# EAGLE schematic AVR-USB2SERIAL (EAGLE 9.6.0)
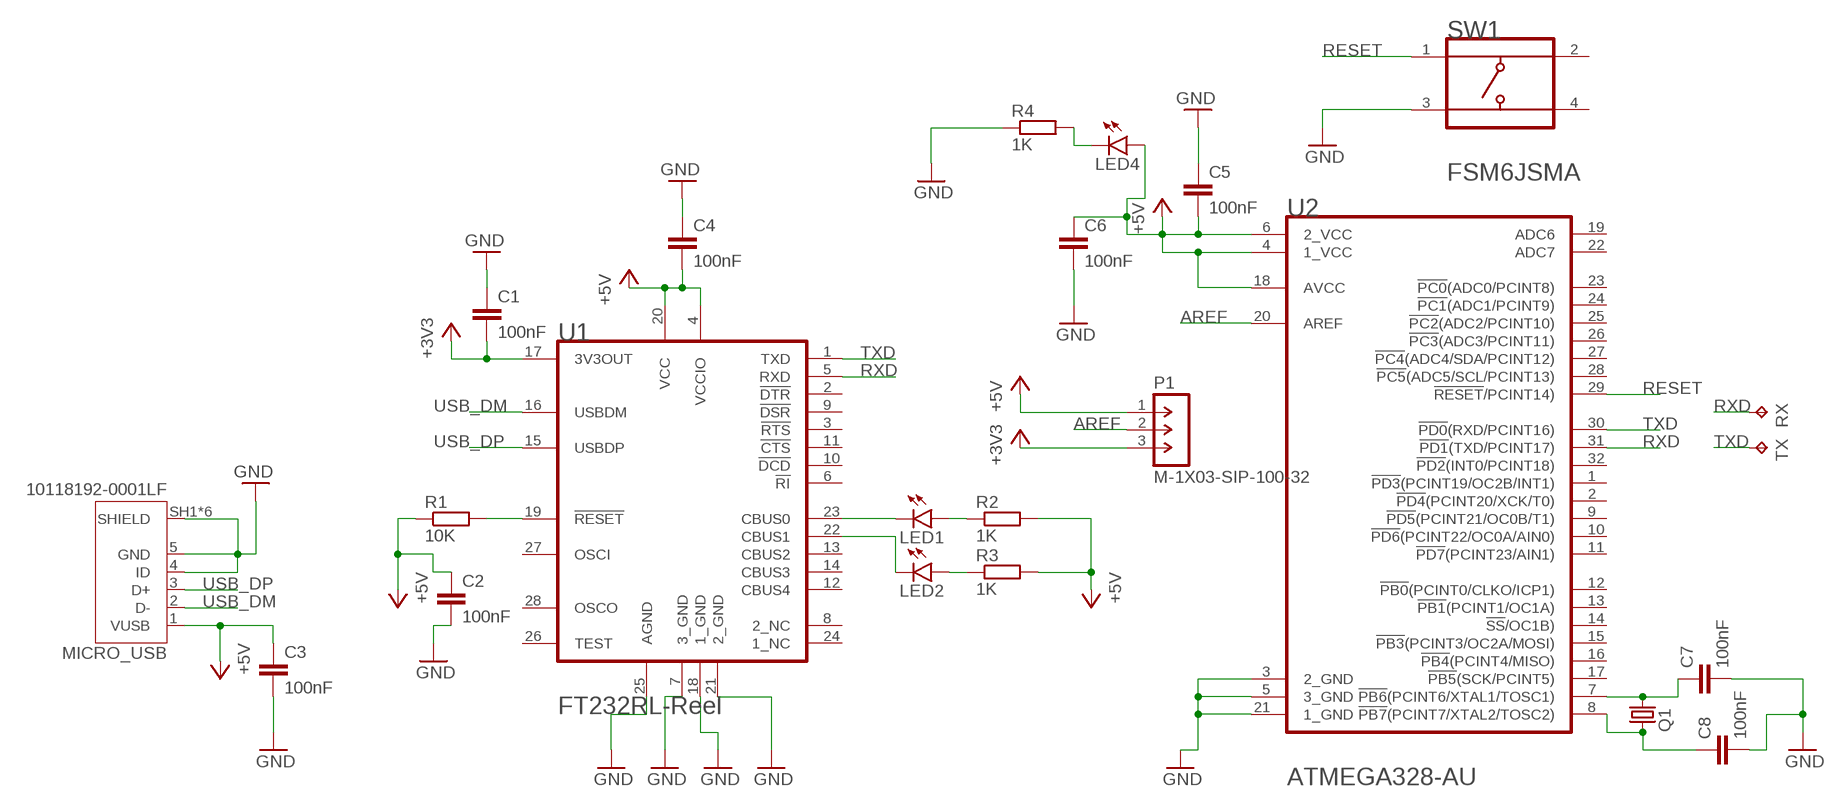
[diagram p0: schematic, sheet 1]

## Parts
C1  100nF  C-EUC0805  [C0805]
C2  100nF  C-EUC0805  [C0805]
C3  100nF  C-EUC0805  [C0805]
C4  100nF  C-EUC0805  [C0805]
C5  100nF  C-EUC0805  [C0805]
C6  100nF  C-EUC0805  [C0805]
C7  100nF  C-EUC0805  [C0805]
C8  100nF  C-EUC0805  [C0805]
LED1  LEDCHIPLED_0805  [CHIPLED_0805]
LED2  LEDCHIPLED_0805  [CHIPLED_0805]
LED4  LEDCHIPLED_0805  [CHIPLED_0805]
MICRO_USB  10118192-0001LF  [AMPHENOL_10118192-0001LF]
P1  M-1X03-SIP-100-32  [SIP-100-03-32]
Q1  CRYSTALHC49UP  [HC49UP]
R1  10K  R-EU_R0805  [R0805]
R2  1K  R-EU_R0805  [R0805]
R3  1K  R-EU_R0805  [R0805]
R4  1K  R-EU_R0805  [R0805]
RX  TPB1,27  [B1,27]
SW1  TE_CONNECTIVITY_ALCOSWITCH_FSM6JSMATE_CONNECTIVITY_ALCOSWITCH_FSM6JSMA_0_0  [TE_CONNECTIVITY_ALCOSWITCH_FSM6JSMA_0]
TX  TPB1,27  [B1,27]
U1  FTDI_FT232RL-REELFTDI_FT232RL-REEL_0_0  [FTDI_FT232RL-REEL_0]
U2  MICROCHIP_-_ATMEL_ATMEGA328-AUMICROCHIP_-_ATMEL_ATMEGA328-AU_0_0  [MICROCHIP_-_ATMEL_ATMEGA328-AU_0]

## Nets
+3V3 [POWER]: C1.2 P1.3 U1.17(3V3OUT)
+5V [POWER]: C2.1 C3.1 C4.2 C5.2 C6.1 LED4.A MICRO_USB.1(VUSB) P1.1 R1.1 R2.2 R3.2 U1.4(VCCIO) U1.20(VCC) U2.4(1_VCC) U2.6(2_VCC) U2.18(AVCC)
AREF: P1.2 U2.20(AREF)
GND [POWER]: C1.1 C2.2 C3.2 C4.1 C5.1 C6.2 C7.2 C8.2 MICRO_USB.4(ID) MICRO_USB.5(GND) MICRO_USB.SH1(SHIELD) MICRO_USB.SH2(SHIELD) MICRO_USB.SH3(SHIELD) MICRO_USB.SH4(SHIELD) MICRO_USB.SH5(SHIELD) MICRO_USB.SH6(SHIELD) R4.1 SW1.3 U1.7(3_GND) U1.18(1_GND) U1.21(2_GND) U1.25(AGND) U2.3(2_GND) U2.5(3_GND) U2.21(1_GND)
N$1: LED1.A R2.1
N$2: R1.2 U1.19(!RESET!)
N$3: LED1.C U1.23(CBUS0)
N$4: LED2.A R3.1
N$5: LED2.C U1.22(CBUS1)
N$6: C7.1 Q1.2 U2.7(!PB6!(PCINT6/XTAL1/TOSC1))
N$7: C8.1 Q1.1 U2.8(!PB7!(PCINT7/XTAL2/TOSC2))
N$8: LED4.C R4.2
RESET: SW1.1 U2.29(!RESET!/PCINT14))
RXD: RX.TP U1.5(RXD) U2.31(!PD1!(TXD/PCINT17))
TXD: TX.TP U1.1(TXD) U2.30(!PD0!(RXD/PCINT16))
USB_DM: MICRO_USB.2(D-) U1.16(USBDM)
USB_DP: MICRO_USB.3(D+) U1.15(USBDP)
Unconnected: SW1.2 SW1.4 U1.2(!DTR!) U1.3(!RTS!) U1.6(!RI!) U1.8(2_NC) U1.9(!DSR!) U1.10(!DCD!) U1.11(!CTS!) U1.12(CBUS4) U1.13(CBUS2) U1.14(CBUS3) U1.24(1_NC) U1.26(TEST) U1.27(OSCI) U1.28(OSCO) U2.1(!PD3!(PCINT19/OC2B/INT1)) U2.2(!PD4!(PCINT20/XCK/T0)) U2.9(!PD5!(PCINT21/OC0B/T1)) U2.10(!PD6!(PCINT22/OC0A/AIN0)) U2.11(!PD7!(PCINT23/AIN1)) U2.12(!PB0!(PCINT0/CLKO/ICP1)) U2.13(!PB1!(PCINT1/OC1A)) U2.14(!SS!/OC1B)) U2.15(!PB3!(PCINT3/OC2A/MOSI)) U2.16(!PB4!(PCINT4/MISO)) U2.17(!PB5!(SCK/PCINT5)) U2.19(ADC6) U2.22(ADC7) U2.23(!PC0!(ADC0/PCINT8)) U2.24(!PC1!(ADC1/PCINT9)) U2.25(!PC2!(ADC2/PCINT10)) U2.26(!PC3!(ADC3/PCINT11)) U2.27(!PC4!(ADC4/SDA/PCINT12)) U2.28(!PC5!(ADC5/SCL/PCINT13)) U2.32(!PD2!(INT0/PCINT18))

## Library data of the parts
C1-C8 = rcl:C-EU: CAPACITOR, European symbol; SPICEPREFIX: C
LED1 LED2 LED4 = led:LED: LED OSRAM: - CHIPLED LG R971, LG N971, LY N971, LG Q971, LY Q971, LO R971, LY R971 LH N974, LH R974 LS Q976, LO Q976, LY Q976 LO Q996 - Hyper CHIPLED LW Q18S LB Q993, LB Q99A, LB R99A - SideLED LS A670, LO A670, LY A670, LG A670, LP A670 LB A673, LV A673, LT A673, LW A673 LH A674 LY A675 LS A676, LA A676, LO A676, LY A676, LW A676 LS A679, LY A679, LG A679 - Hyper Micro SIDELED® LS Y876, LA Y876, LO Y876, LY Y876 LT Y87S - SmartLED LW L88C, LW L88S LB L89C, LB L89S, LG L890 LS L89K, LO L89K, LY L89K LS L896, LA L896, LO L896, LY L896 - TOPLED LS T670, LO T670, LY T670, LG T670, LP T670 LSG T670, LSP T670, LSY T670, LOP T670, LYG T670 LG T671, LOG T671, LSG T671 LB T673, LV T673, LT T673, LW T673 LH T674 LS T676, LA T676, LO T676, LY T676, LB T676, LH T676, LSB T676, LW T676 LB T67C, LV T67C, LT T67C, LS T67K, LO T67K, LY T67K, LW E67C LS E67B, LA E67B, LO E67B, LY E67B, LB E67C, LV E67C, LT E67C LW T67C LS T679, LY T679, LG T679 LS T770, LO T770, LY T770, LG T770, LP T770 LB T773, LV T773, LT T773, LW T773 LH T774 LS E675, LA E675, LY E675, LS T675 LS T776, LA T776, LO T776, LY T776, LB T776 LHGB T686 LT T68C, LB T68C - Hyper Mini TOPLED® LB M676 - Mini TOPLED Santana® LG M470 LS M47K, LO M47K, LY M47K Source: http://www.osram.convergy.de LUXEON: - LUMILED® LXK2-PW12-R00, LXK2-PW12-S00, LXK2-PW14-U00, LXK2-PW14-V00 LXK2-PM12-R00, LXK2-PM12-S00, LXK2-PM14-U00 LXK2-PE12-Q00, LXK2-PE12-R00, LXK2-PE12-S00, LXK2-PE14-T00, LXK2-PE14-U00 LXK2-PB12-K00, LXK2-PB12-L00, LXK2-PB12-M00, LXK2-PB14-N00, LXK2-PB14-P00, LXK2-PB14-Q00 LXK2-PR12-L00, LXK2-PR12-M00, LXK2-PR14-Q00, LXK2-PR14-R00 LXK2-PD12-Q00, LXK2-PD12-R00, LXK2-PD12-S00 LXK2-PH12-R00, LXK2-PH12-S00 LXK2-PL12-P00, LXK2-PL12-Q00, LXK2-PL12-R00 Source: www.luxeon.com KINGBRIGHT: KA-3528ASYC Source: www.kingbright.com
MICRO_USB = 10118192-0001LF:10118192-0001LF: Single Port 5 Contact Horizontal Right Angle Shielded Micro B USB 2.0 Connector; AVAILABILITY: Unavailable; DESCRIPTION: USB - micro B USB 2.0 Receptacle Connector 5 Position Surface Mount, Right Angle; MF: Amphenol ICC; MP: 10118192-0001LF; PACKAGE: None; PRICE: None
P1 = con-headers-jp:M-1X03-: MALE HEADER
Q1 = crystal:CRYSTAL: CRYSTAL; OC_FARNELL: unknown; OC_NEWARK: unknown
R1-R4 = rcl:R-EU_: RESISTOR, European symbol; SPICEPREFIX: R
RX TX = testpad:TP: Test pad
SW1 = TE Connectivity Alcoswitch - FSM6JSMA:TE_CONNECTIVITY_ALCOSWITCH_FSM6JSMA: SW-SPST-4_A; ACTUATOR_LENGTH: 3.4mm; ACTUATOR_MATERIAL: Polyamide; CASE_PACKAGE: SMD/SMT; CIIVA_IDS: 1274973; CONTACT_CURRENT_RATING: 50mA; CONTACT_MATERIAL: CopperAlloy; CONTACT_PLATING: Silver; CONTACT_RESISTANCE: 100mOhm; CURRENT_RATING: 50mA; DATASHEET_URL: http://www.te.com/commerce/DocumentDelivery/DDEController?Action=showdoc&DocId=Customer+Drawing%7F2-1437565-7%7FV%7Fpdf%7FEnglish%7FENG_CD_2-1437565-7_V.pdf%7F4-1437565-9; DATASHEET_VERSION: Rev. V, 02/2015; ELECTRICAL_LIFE: 100000Cycles; ELV: Compliant; FOOTPRINT_VARIANT_NAME_0: Manufacturer Recommended; ILLUMINATION_TYPE: Illuminated; IMPORTED: yes; IMPORTED_FROM: vault; IMPORT_TS: 1521849377; INSULATION_RESISTANCE: 100MOhm; LEAD_FREE: LeadFree; LENGTH: 6mm; MANUFACTURER_URL: http://www.te.com/; MAX_OPERATING_TEMPERATURE: 85degC; MAX_VOLTAGE_RATING_DC: 12V; MECHANICAL_LIFE: 100000Cycles; MF: TE Connectivity Alcoswitch; MIN_OPERATING_TEMPERATURE: -35degC; MOUNT: SurfaceMount; MOUNTING_TECHNOLOGY: SurfaceMount; MPN: FSM6JSMA; OPERATING_FORCE: 1.57N; ORIENTATION: Straight; PACKAGE_DESCRIPTION: 4-Pin Surface Mount Device, Body 6 x 6 mm, Pitch 4.5 mm; PACKAGE_QUANTITY: 750; PACKAGE_REFERENCE: FSM6JSMA; PACKAGING: LoosePiece; PREFIX: SW; REACH_SVHC: Unknown; RELEASE_DATE: 1509013769; RO_HSCOMPLIANT: true; SWITCH_TRAVEL: 0.25mm; TERMINATION: GullWing; THROW_CONFIGURATION: SPST; VAULT_GUID: D91E59A4-7ECE-42E7-B8F2-8FC7849F8004; VAULT_REVISION: 6365A965-D9F5-4BD9-837C-B5AE3D60004A; VOLTAGE_RATING: 24V; VOLTAGE_RATING_DC: 24V; WIDTH: 6mm
U1 = FTDI - FT232RL-Reel:FTDI_FT232RL-REEL: COM-UART-FT232R-IL28; CIIVA_IDS: 1315748; COMPONENT_LINK_1_DESCRIPTION: Manufacturer URL; COMPONENT_LINK_1_URL: http://www.ftdichip.com/; DATASHEET: http://www.ftdichip.com/Support/Documents/DataSheets/ICs/DS_FT232R.pdf; DATASHEET_VERSION: ver 2.10, Mar-2012; FOOTPRINT_VARIANT_NAME_0: Level C; FOOTPRINT_VARIANT_NAME_1: Level B; FOOTPRINT_VARIANT_NAME_2: Level A; IMPORTED: yes; IMPORTED_FROM: vault; IMPORT_TS: 1521861698; MF: FTDI; MPN: FT232RL-Reel; PACKAGE: SSOP-28; PACKAGE_DESCRIPTION: 28-Pin Small Outline Package 0.65 mm Pitch; PACKAGE_VERSION: Mar-12; PREFIX: U; RELEASE_DATE: 1383903520; VAULT_GUID: DB808BAC-7AAA-4FBB-A28B-8882F1AB516B; VAULT_REVISION: EB4419C0-B99E-4E79-9F0E-CB6725B6F5C3
U2 = Atmel - ATMEGA328-AU:MICROCHIP_-_ATMEL_ATMEGA328-AU: MC-8B-ATM48-SQ32; CIIVA_IDS: 973152; CODE__JEDEC: MS-026-ABA; COMPONENT_LINK_1_DESCRIPTION: Manufacturer URL; COMPONENT_LINK_1_URL: http://www.atmel.com/; COMPONENT_LINK_2_DESCRIPTION: ATmega48A/48PA/88A/88PA/168A/168PA/328/328P Datasheet; COMPONENT_LINK_2_URL: http://www.atmel.com/dyn/resources/prod_documents/doc8271.pdf; COMPONENT_LINK_3_DESCRIPTION: ATmega48A/48PA/88A/88PA/168A/168PA/328/328P Summary; COMPONENT_LINK_3_URL: http://www.atmel.com/dyn/resources/prod_documents/8271S.pdf; DATASHEET_VERSION: revD, May-2011; FOOTPRINT_VARIANT_NAME_0: Level C; FOOTPRINT_VARIANT_NAME_1: Level B; FOOTPRINT_VARIANT_NAME_2: Level A; IMPORTED: yes; IMPORTED_FROM: vault; IMPORT_TS: 1521842114; MF: Microchip / Atmel; MPN: ATMEGA328-AU; PACKAGE: 32A; PACKAGE_DESCRIPTION: 32-Lead, 7x7x1.0 mm Body, 0.8mm Lead Pitch, Thin Profile Plastic Quad Flat Package (TQFP); PACKAGE_VERSION: revC, Oct-2010; PREFIX: U; RELEASE_DATE: 1329192833; VAULT_GUID: 9C186FDE-8933-428E-A95B-EB13328C5247; VAULT_REVISION: 6883B2D0-8A53-4E66-B76E-D365AF1F7F8B

## Net classes
0 default: width 0.5 mm, drill 0.3 mm, clearance 0.3 mm
1 POWER: width 0.8 mm, drill 0.3 mm, clearance 0.3 mm